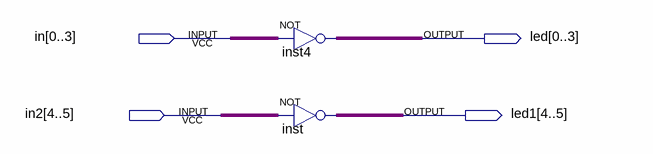
[diagram p0: schematic sheet]
// Quartus schematic Block2.bdf as structural Verilog: 2 symbols, 4 pins
module Block2 (
  input  [0:3] in,
  input  [4:5] in2,
  output [0:3] led,
  output [4:5] led1
);

  assign led = ~in;  // NOT inst4, 4 bits wide
  assign led1 = ~in2;  // NOT inst, 2 bits wide
endmodule
